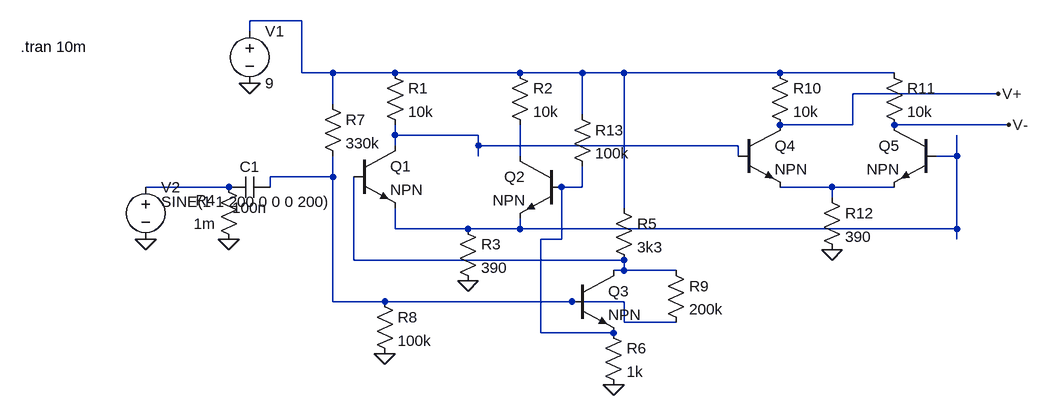
[diagram p0: schematic amplifiers.asc]
amplifiers.asc, the LTspice schematic file:
Version 4
SHEET 1 1304 752
WIRE 176 176 96 176
WIRE 96 192 96 176
WIRE 176 256 176 176
WIRE 224 256 176 256
WIRE 320 256 224 256
WIRE 512 256 320 256
WIRE 608 256 512 256
WIRE 672 256 608 256
WIRE 912 256 672 256
WIRE 1088 256 912 256
WIRE 1248 288 1024 288
WIRE 224 304 224 256
WIRE 608 320 608 256
WIRE 1024 336 1024 288
WIRE 1024 336 912 336
WIRE 1264 336 1088 336
WIRE 320 352 320 336
WIRE 448 352 320 352
WIRE 320 368 320 352
WIRE 448 368 448 352
WIRE 848 368 448 368
WIRE 448 384 448 368
WIRE 512 384 512 336
WIRE 848 384 848 368
WIRE 1184 384 1184 352
WIRE 1184 384 1152 384
WIRE 224 416 224 384
WIRE 224 416 128 416
WIRE 64 432 -64 432
WIRE 128 432 128 416
WIRE 608 432 608 400
WIRE 608 432 576 432
WIRE 992 432 912 432
WIRE 1088 432 992 432
WIRE 992 448 992 432
WIRE 672 464 672 256
WIRE 320 496 320 464
WIRE 432 496 320 496
WIRE 512 496 512 480
WIRE 512 496 432 496
WIRE 1184 496 1184 384
WIRE 1184 496 512 496
WIRE 576 512 576 432
WIRE 576 512 544 512
WIRE 1184 512 1184 496
WIRE 256 544 256 416
WIRE 672 544 256 544
WIRE 672 560 672 544
WIRE 672 560 656 560
WIRE 752 560 672 560
WIRE 224 608 224 416
WIRE 304 608 224 608
WIRE 592 608 304 608
WIRE 672 608 592 608
WIRE 672 640 672 608
WIRE 752 640 672 640
WIRE 544 656 544 512
WIRE 656 656 544 656
FLAG -64 512 0
FLAG 96 272 0
FLAG 432 576 0
FLAG 64 512 0
FLAG 656 736 0
FLAG 304 688 0
FLAG 1248 288 V+
FLAG 1264 336 V-
FLAG 992 528 0
SYMBOL voltage 96 176 R0
SYMATTR InstName V1
SYMATTR Value 9
SYMBOL voltage -64 416 R0
WINDOW 3 24 38 Left 2
SYMATTR Value SINE(1 1 200 0 0 0 200)
SYMATTR InstName V2
SYMBOL res 304 240 R0
SYMATTR InstName R1
SYMATTR Value 10k
SYMBOL res 496 240 R0
SYMATTR InstName R2
SYMATTR Value 10k
SYMBOL res 416 480 R0
SYMATTR InstName R3
SYMATTR Value 390
SYMBOL cap 128 416 R90
WINDOW 0 0 32 VBottom 2
WINDOW 3 32 32 VTop 2
SYMATTR InstName C1
SYMATTR Value 100n
SYMBOL res 80 528 R180
WINDOW 0 36 76 Left 2
WINDOW 3 36 40 Left 2
SYMATTR InstName R4
SYMATTR Value 1m
SYMBOL npn 256 368 R0
SYMATTR InstName Q1
SYMBOL npn 576 384 M0
SYMATTR InstName Q2
SYMBOL npn 592 560 R0
SYMATTR InstName Q3
SYMBOL res 656 448 R0
SYMATTR InstName R5
SYMATTR Value 3k3
SYMBOL res 640 640 R0
SYMATTR InstName R6
SYMATTR Value 1k
SYMBOL res 208 288 R0
SYMATTR InstName R7
SYMATTR Value 330k
SYMBOL res 288 592 R0
SYMATTR InstName R8
SYMATTR Value 100k
SYMBOL res 736 544 R0
SYMATTR InstName R9
SYMATTR Value 200k
SYMBOL res 896 240 R0
SYMATTR InstName R10
SYMATTR Value 10k
SYMBOL res 1072 240 R0
SYMATTR InstName R11
SYMATTR Value 10k
SYMBOL res 976 432 R0
SYMATTR InstName R12
SYMATTR Value 390
SYMBOL npn 848 336 R0
SYMATTR InstName Q4
SYMBOL npn 1152 336 M0
SYMATTR InstName Q5
SYMBOL res 592 304 R0
SYMATTR InstName R13
SYMATTR Value 100k
TEXT -256 216 Left 2 !.tran 10m

The netlist it stands for:
* amplifiers.asc
V1 N001 0 9
V2 N006 0 SINE(1 1 200 0 0 0 200)
R1 N001 N002 10k
R2 N001 N003 10k
R3 N004 0 390
C1 N005 N006 100n
R4 0 N006 1m
Q1 N002 N009 N004 0 NPN
Q2 N003 N007 N004 0 NPN
Q3 N009 N005 N007 0 NPN
R5 N001 N009 3k3
R6 N007 0 1k
R7 N001 N005 330k
R8 N005 0 100k
R9 N009 N005 200k
R10 N001 V+ 10k
R11 N001 V- 10k
R12 N008 0 390
Q4 V+ N002 N008 0 NPN
Q5 V- N004 N008 0 NPN
R13 N001 N007 100k
.model NPN NPN
.model PNP PNP
.lib standard.bjt
.tran 10m
.backanno
.end